# Altium schematic sheet IO.SchDoc: IO
size 420 x 297 mm; DocumentNumber: 6; SheetNumber: 2; SheetTotal: 15
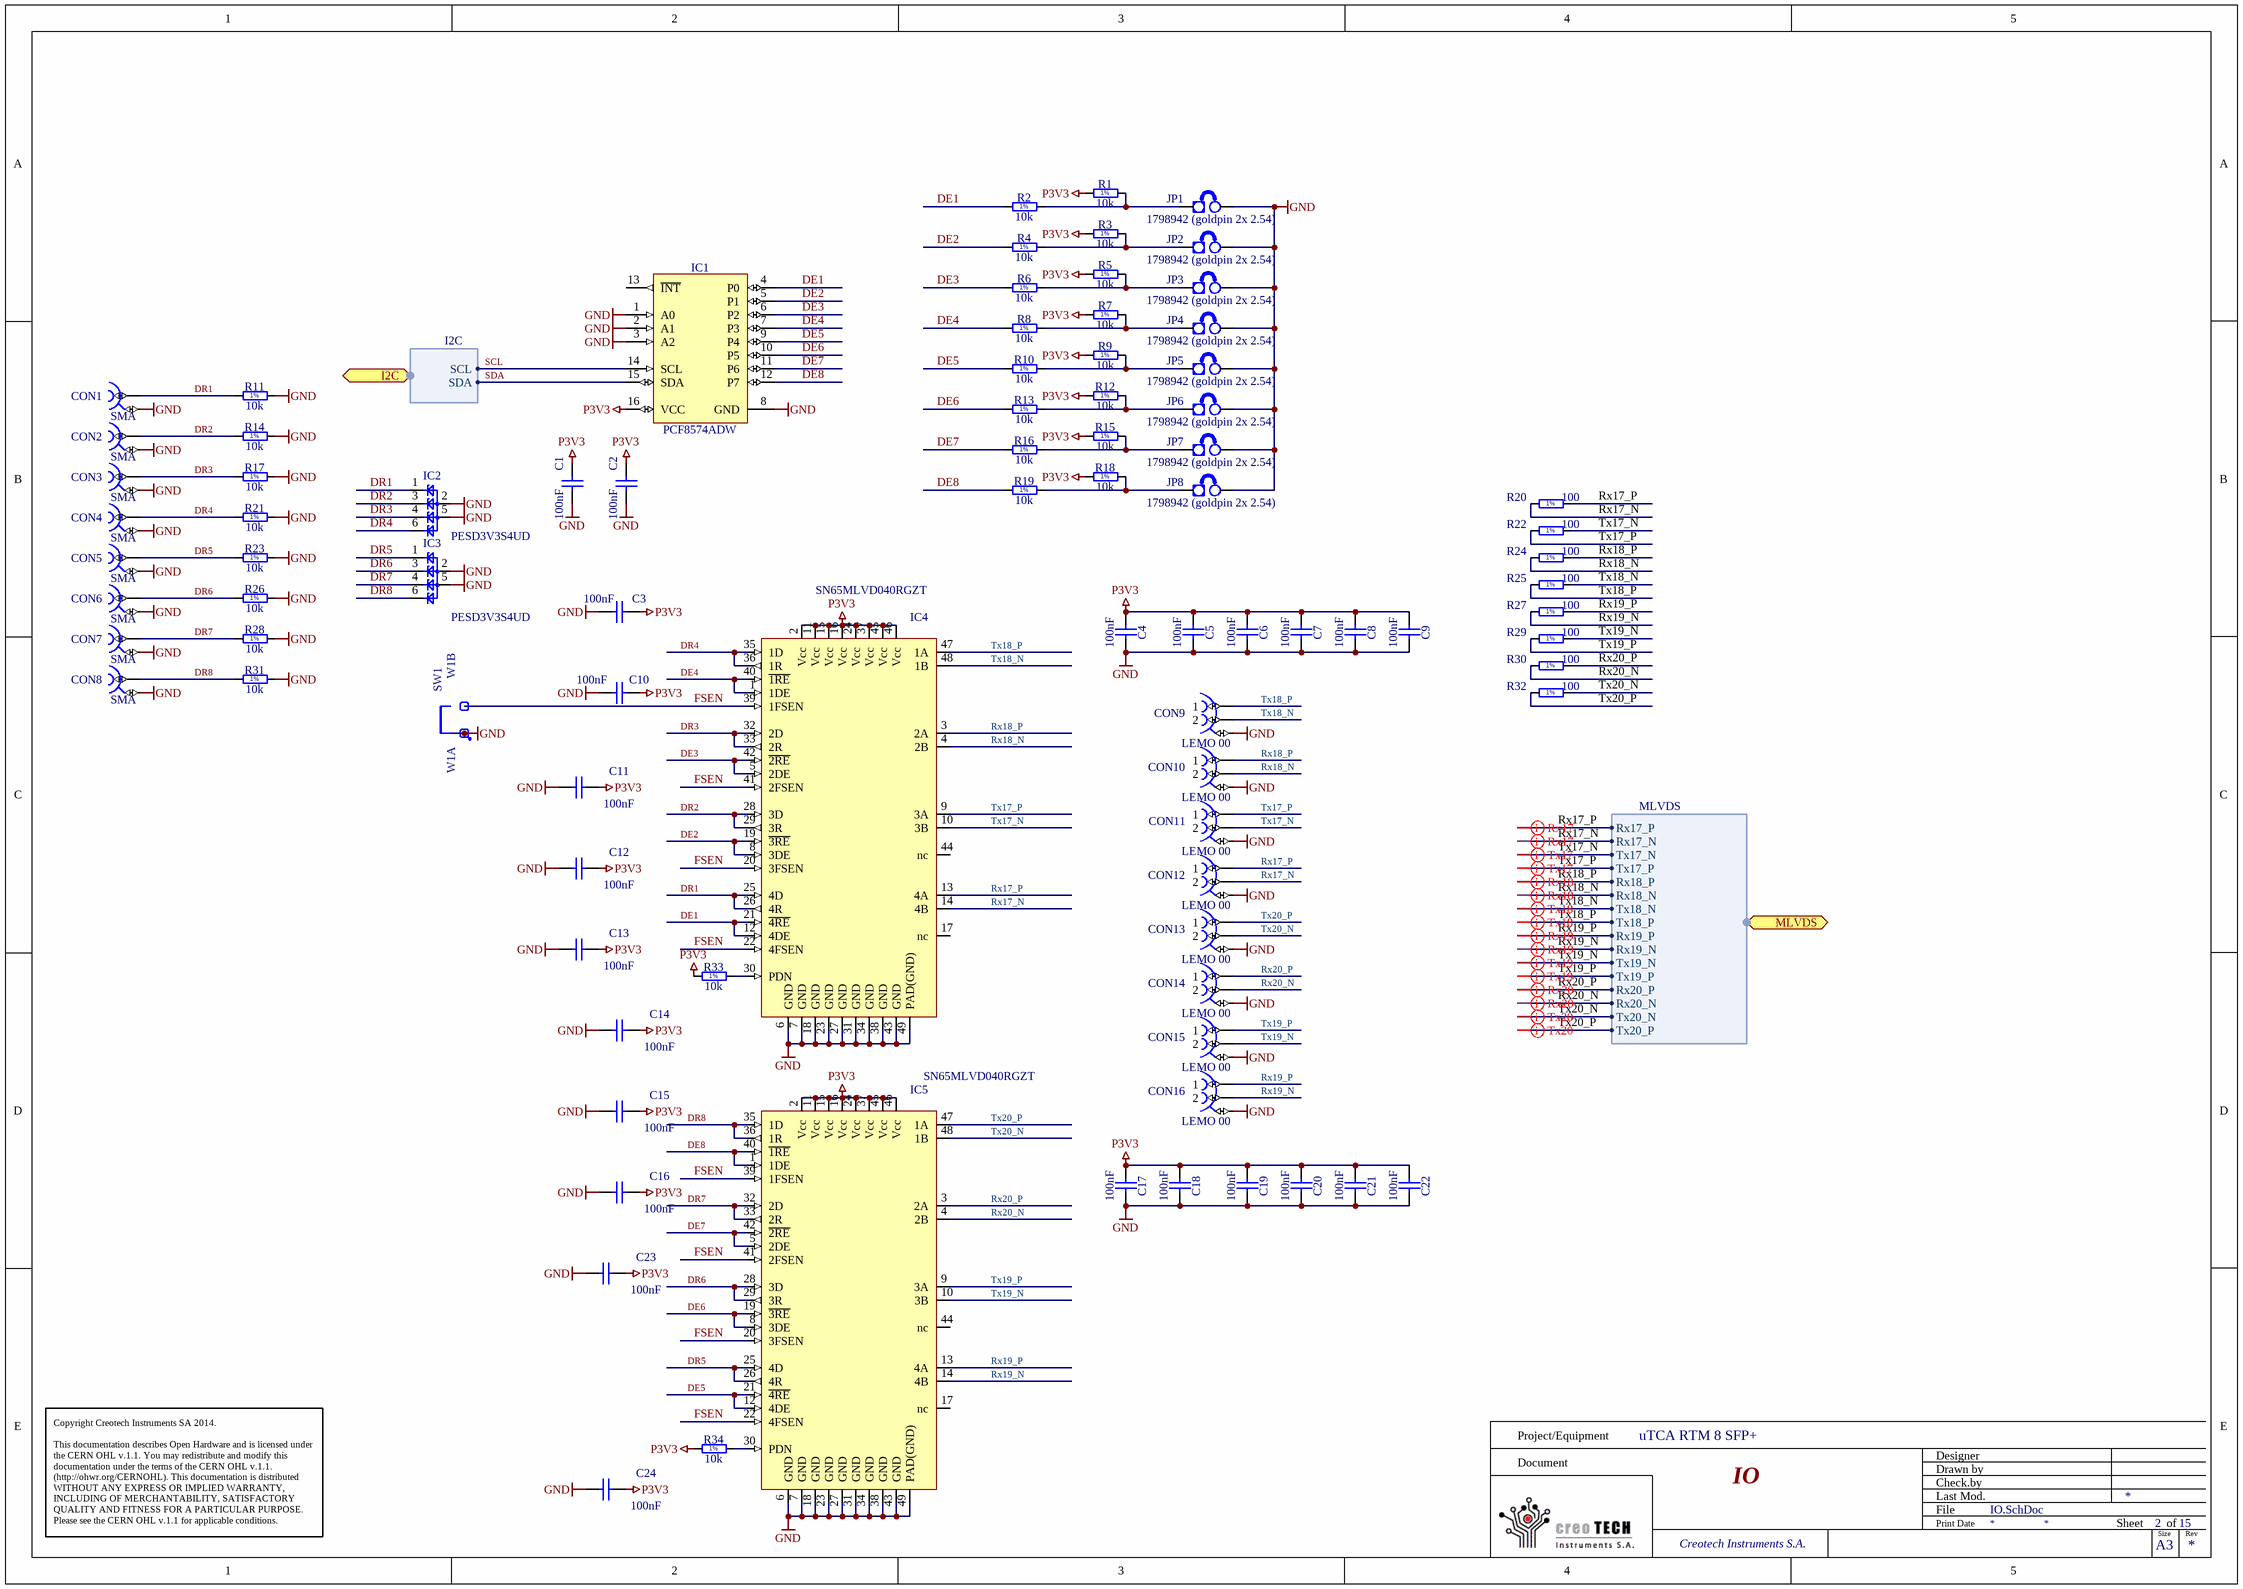
[diagram p0: IO.SchDoc]

## Parts
C1  100nF  [CAPC0603X33N]
C2  100nF  [CAPC0603X33N]
C3  100nF  [CAPC0603X33N]
C4  100nF  [CAPC0603X33N]
C5  100nF  [CAPC0603X33N]
C6  100nF  [CAPC0603X33N]
C7  100nF  [CAPC0603X33N]
C8  100nF  [CAPC0603X33N]
C9  100nF  [CAPC0603X33N]
C10  100nF  [CAPC0603X33N]
C11  100nF  [CAPC0603X33N]
C12  100nF  [CAPC0603X33N]
C13  100nF  [CAPC0603X33N]
C14  100nF  [CAPC0603X33N]
C15  100nF  [CAPC0603X33N]
C16  100nF  [CAPC0603X33N]
C17  100nF  [CAPC0603X33N]
C18  100nF  [CAPC0603X33N]
C19  100nF  [CAPC0603X33N]
C20  100nF  [CAPC0603X33N]
C21  100nF  [CAPC0603X33N]
C22  100nF  [CAPC0603X33N]
C23  100nF  [CAPC0603X33N]
C24  100nF  [CAPC0603X33N]
CON1  SMA  [HUBER-SUHNER_85 SMA-50-0-101/111 NE]
CON2  SMA  [HUBER-SUHNER_85 SMA-50-0-101/111 NE]
CON3  SMA  [HUBER-SUHNER_85 SMA-50-0-101/111 NE]
CON4  SMA  [HUBER-SUHNER_85 SMA-50-0-101/111 NE]
CON5  SMA  [HUBER-SUHNER_85 SMA-50-0-101/111 NE]
CON6  SMA  [HUBER-SUHNER_85 SMA-50-0-101/111 NE]
CON7  SMA  [HUBER-SUHNER_85 SMA-50-0-101/111 NE]
CON8  SMA  [HUBER-SUHNER_85 SMA-50-0-101/111 NE]
CON9  LEMO 00  [LEMO_EPG.00.302.NLN]
CON10  LEMO 00  [LEMO_EPG.00.302.NLN]
CON11  LEMO 00  [LEMO_EPG.00.302.NLN]
CON12  LEMO 00  [LEMO_EPG.00.302.NLN]
CON13  LEMO 00  [LEMO_EPG.00.302.NLN]
CON14  LEMO 00  [LEMO_EPG.00.302.NLN]
CON15  LEMO 00  [LEMO_EPG.00.302.NLN]
CON16  LEMO 00  [LEMO_EPG.00.302.NLN]
IC1  PCF8574ADW  [SOIC127P1030X265-16N]
IC2  PESD3V3S4UD  [SOT457]
IC3  PESD3V3S4UD  [SOT457]
IC4  SN65MLVD040RGZT  [QFN48L]
IC5  SN65MLVD040RGZT  [QFN48L]
JP1  1798942 (goldpin 2x 2.54)  [HEADER2x1 2.54mm]
JP2  1798942 (goldpin 2x 2.54)  [HEADER2x1 2.54mm]
JP3  1798942 (goldpin 2x 2.54)  [HEADER2x1 2.54mm]
JP4  1798942 (goldpin 2x 2.54)  [HEADER2x1 2.54mm]
JP5  1798942 (goldpin 2x 2.54)  [HEADER2x1 2.54mm]
JP6  1798942 (goldpin 2x 2.54)  [HEADER2x1 2.54mm]
JP7  1798942 (goldpin 2x 2.54)  [HEADER2x1 2.54mm]
JP8  1798942 (goldpin 2x 2.54)  [HEADER2x1 2.54mm]
R1  10k  [RESC1005X40N]
R2  10k  [RESC1005X40N]
R3  10k  [RESC1005X40N]
R4  10k  [RESC1005X40N]
R5  10k  [RESC1005X40N]
R6  10k  [RESC1005X40N]
R7  10k  [RESC1005X40N]
R8  10k  [RESC1005X40N]
R9  10k  [RESC1005X40N]
R10  10k  [RESC1005X40N]
R11  10k  [RESC1005X40N]
R12  10k  [RESC1005X40N]
R13  10k  [RESC1005X40N]
R14  10k  [RESC1005X40N]
R15  10k  [RESC1005X40N]
R16  10k  [RESC1005X40N]
R17  10k  [RESC1005X40N]
R18  10k  [RESC1005X40N]
R19  10k  [RESC1005X40N]
R20  100  [RESC1005X40N]
R21  10k  [RESC1005X40N]
R22  100  [RESC1005X40N]
R23  10k  [RESC1005X40N]
R24  100  [RESC1005X40N]
R25  100  [RESC1005X40N]
R26  10k  [RESC1005X40N]
R27  100  [RESC1005X40N]
R28  10k  [RESC1005X40N]
R29  100  [RESC1005X40N]
R30  100  [RESC1005X40N]
R31  10k  [RESC1005X40N]
R32  100  [RESC1005X40N]
R33  10k  [RESC1005X40N]
R34  10k  [RESC1005X40N]
SW1  Jumper Type1  [JUMPER_BLACK_INSULATED_2.54MM]  (value not drawn)
W1  Test Point  [COMATEL_385.0358.1.02.400]  (value not drawn)  (parts A,B of 2)

## Ports
I2C (harness I2C), MLVDS (harness MLVDS)

## Harnesses
MLVDS: Rx17_P, Rx17_N, Tx17_N, Tx17_P, Rx18_P, Rx18_N, Tx18_N, Tx18_P, Rx19_P, Rx19_N, Tx19_N, Tx19_P, Rx20_P, Rx20_N, Tx20_N, Tx20_P
I2C: SCL, SDA

## Nets
GND: C1.1 C2.1 C3.1 C4.2 C5.2 C6.2 C7.2 C8.2 C9.2 C10.1 C11.2 C12.2 C13.2 C14.2 C15.2 C16.2 C17.2 C18.2 C19.2 C20.2 C21.2 C22.2 C23.2 C24.2 CON1.2 CON2.2 CON3.2 CON4.2 CON5.2 CON6.2 CON7.2 CON8.2 CON9.3 CON10.3 CON11.3 CON12.3 CON13.3 CON14.3 CON15.3 CON16.3 IC1.1(A0) IC1.2(A1) IC1.3(A2) IC1.8(GND) IC2.2 IC2.5 IC3.2 IC3.5 IC4.6(GND) IC4.7(GND) IC4.18(GND) IC4.23(GND) IC4.27(GND) IC4.31(GND) IC4.34(GND) IC4.38(GND) IC4.43(GND) IC4.49(PAD(GND)) IC5.6(GND) IC5.7(GND) IC5.18(GND) IC5.23(GND) IC5.27(GND) IC5.31(GND) IC5.34(GND) IC5.38(GND) IC5.43(GND) IC5.49(PAD(GND)) JP1.2(E2) JP2.2(E2) JP3.2(E2) JP4.2(E2) JP5.2(E2) JP6.2(E2) JP7.2(E2) JP8.2(E2) R11.2 R14.2 R17.2 R21.2 R23.2 R26.2 R28.2 R31.2 SW1.1 W1.1
P3V3: C1.2 C2.2 C3.2 C4.1 C5.1 C6.1 C7.1 C8.1 C9.1 C10.2 C11.1 C12.1 C13.1 C14.1 C15.1 C16.1 C17.1 C18.1 C19.1 C20.1 C21.1 C22.1 C23.1 C24.1 IC1.16(VCC) IC4.2(Vcc) IC4.11(Vcc) IC4.15(Vcc) IC4.16(Vcc) IC4.24(Vcc) IC4.37(Vcc) IC4.45(Vcc) IC4.46(Vcc) IC5.2(Vcc) IC5.11(Vcc) IC5.15(Vcc) IC5.16(Vcc) IC5.24(Vcc) IC5.37(Vcc) IC5.45(Vcc) IC5.46(Vcc) R1.1 R3.1 R5.1 R7.1 R9.1 R12.1 R15.1 R18.1 R33.1 R34.1
DE1: IC1.4(P0) IC4.12(4DE) IC4.21(~{4RE}) R2.1
DE2: IC1.5(P1) IC4.8(3DE) IC4.19(~{3RE}) R4.1
DE3: IC1.6(P2) IC4.5(2DE) IC4.42(~{2RE}) R6.1
DE4: IC1.7(P3) IC4.1(1DE) IC4.40(~{1RE}) R8.1
DE5: IC1.9(P4) IC5.12(4DE) IC5.21(~{4RE}) R10.1
DE6: IC1.10(P5) IC5.8(3DE) IC5.19(~{3RE}) R13.1
DE7: IC1.11(P6) IC5.5(2DE) IC5.42(~{2RE}) R16.1
DE8: IC1.12(P7) IC5.1(1DE) IC5.40(~{1RE}) R19.1
DR1: CON1.1 IC2.1 IC4.25(4D) IC4.26(4R) R11.1
DR2: CON2.1 IC2.3 IC4.28(3D) IC4.29(3R) R14.1
DR3: CON3.1 IC2.4 IC4.32(2D) IC4.33(2R) R17.1
DR4: CON4.1 IC2.6 IC4.35(1D) IC4.36(1R) R21.1
DR5: CON5.1 IC3.1 IC5.25(4D) IC5.26(4R) R23.1
DR6: CON6.1 IC3.3 IC5.28(3D) IC5.29(3R) R26.1
DR7: CON7.1 IC3.4 IC5.32(2D) IC5.33(2R) R28.1
DR8: CON8.1 IC3.6 IC5.35(1D) IC5.36(1R) R31.1
FSEN: IC4.20(3FSEN) IC4.22(4FSEN) IC4.39(1FSEN) IC4.41(2FSEN) IC5.20(3FSEN) IC5.22(4FSEN) IC5.39(1FSEN) IC5.41(2FSEN) W1.2
Rx17_N: CON12.2 IC4.14(4B) R20.1 ; port MLVDS.Rx17_N
Rx17_P: CON12.1 IC4.13(4A) R20.2 ; port MLVDS.Rx17_P
Rx18_N: CON10.2 IC4.4(2B) R24.1 ; port MLVDS.Rx18_N
Rx18_P: CON10.1 IC4.3(2A) R24.2 ; port MLVDS.Rx18_P
Rx19_N: CON16.2 IC5.14(4B) R27.1 ; port MLVDS.Rx19_N
Rx19_P: CON16.1 IC5.13(4A) R27.2 ; port MLVDS.Rx19_P
Rx20_N: CON14.2 IC5.4(2B) R30.1 ; port MLVDS.Rx20_N
Rx20_P: CON14.1 IC5.3(2A) R30.2 ; port MLVDS.Rx20_P
SCL: IC1.14(SCL) ; port I2C.SCL
SDA: IC1.15(SDA) ; port I2C.SDA
Tx17_N: CON11.2 IC4.10(3B) R22.2 ; port MLVDS.Tx17_N
Tx17_P: CON11.1 IC4.9(3A) R22.1 ; port MLVDS.Tx17_P
Tx18_N: CON9.2 IC4.48(1B) R25.2 ; port MLVDS.Tx18_N
Tx18_P: CON9.1 IC4.47(1A) R25.1 ; port MLVDS.Tx18_P
Tx19_N: CON15.2 IC5.10(3B) R29.2 ; port MLVDS.Tx19_N
Tx19_P: CON15.1 IC5.9(3A) R29.1 ; port MLVDS.Tx19_P
Tx20_N: CON13.2 IC5.48(1B) R32.2 ; port MLVDS.Tx20_N
Tx20_P: CON13.1 IC5.47(1A) R32.1 ; port MLVDS.Tx20_P
NetIC4_30: IC4.30(PDN) R33.2
NetIC5_30: IC5.30(PDN) R34.2
NetJP1_1: JP1.1(E1) R1.2 R2.2
NetJP2_1: JP2.1(E1) R3.2 R4.2
NetJP3_1: JP3.1(E1) R5.2 R6.2
NetJP4_1: JP4.1(E1) R7.2 R8.2
NetJP5_1: JP5.1(E1) R9.2 R10.2
NetJP6_1: JP6.1(E1) R12.2 R13.2
NetJP7_1: JP7.1(E1) R15.2 R16.2
NetJP8_1: JP8.1(E1) R18.2 R19.2

Not connected (* = marked no-connect by the designer): IC1 13(~{INT}); IC4 17(nc) 44(nc); IC5 17(nc) 44(nc)

## Layout directives
differential pair: Rx17_N, Rx17_P, Rx18_N, Rx18_P, Rx19_N, Rx19_P, Rx20_N, Rx20_P, Tx17_N, Tx17_P, Tx18_N, Tx18_P, Tx19_N, Tx19_P, Tx20_N, Tx20_P

## Notes on the sheet
- Project/Equipment
- Document
- uTCA RTM 8 SFP+
- Designer
- Drawn by
- Check.by
- Copyright Creotech Instruments SA 2014.
  This documentation describes Open Hardware and is licensed under the CERN OHL v.1.1. You may redistribute and modify this documentation under the terms of the CERN OHL v.1.1. (http://ohwr.org/CERNOHL). This documentation is distributed WITHOUT ANY EXPRESS OR IMPLIED WARRANTY, INCLUDING OF MERCHANTABILITY, SATISFACTORY QUALITY AND FITNESS FOR A PARTICULAR PURPOSE. Please see the CERN OHL v.1.1 for applicable conditions.
- Creotech Instruments S.A.
- File
- Last Mod.
- Print Date
- Sheet
- Size
- A3
- of
- Rev
- (in symbol R0402_10K_1%_0.0625W_100PPM) 1%
- (in symbol R0402_100R_1%_0.0625W_100PPM) 1%

## Library data of the parts
C1-C24 = CC0201_100NF_6.3V_10%_X5R: Non-polarised capacitor; Part Description: SMD Multilayer Chip Ceramic Capacitor; Manufacturer: GENERIC; Manufacturer1 Part Number: 02016D104KAT2A; Voltage: 6.3V; TC: X5R; Tolerance: ±10%; Table: Capacitors SMD; Part Number: CC0201_100NF_6.3V_10%_X5R; Component Kind: Standard; Component Type: Standard; Pin Count: 2; Value: 100nF; Status: Not Recommended; Manufacturer Part Number: CC0201_100NF_6.3V_10%_X5R; Case: 0201; Mounted: Yes; Socket: No; SMD: Yes; Manufacturer1 Example: AVX; Manufacturer1 ComponentHeight: 0.33mm; HelpURL: \\cern.ch\dfs\Applications\Altium\Datasheets\CC0201_X5R_AVX.pdf; Author: CERN DEM JLC; CreateDate: 2007-12-03; LatestRevisionDate: 2007-12-03
CON1-CON8 = HUBER-SUHNER_85_SMA-50-0-101/111_NE: Part Description: SMA 50 Ohms Right Angle PCB Jack; Manufacturer: HUBER+SUHNER; Table: Miscellaneous; Part Number: HUBER-SUHNER_85_SMA-50-0-101/111_NE; Component Kind: Standard; Component Type: Standard; Pin Count: 2; Family: SMA; Mounted: Yes; Socket: No; SMD: No; Status: None; Manufacturer Part Number: 85_SMA-50-0-101/111_NE; ComponentHeight: 9.6mm; HelpURL: \\cern.ch\dfs\Applications\Altium\Datasheets\HUBER-SUHNER_85 SMA-50-0-101-111 NE.pdf; Author: CERN DEM JLC; CreateDate: 2010-04-20; LatestRevisionDate: 2010-04-27
CON9-CON16 = LEMO_EPG.00.302.NLN: Part Description: Size 00, Elbow Socket (90°) With 2 Female Contacts and Alignment Key (G); SCEM: 09.31.28.007.2; Part Number: LEMO_EPG.00.302.NLN; Component Kind: Standard; Component Type: Standard; Pin Count: 3; Family: LEMO 00; Mounted: Yes; Socket: No; SMD: No; Status: None; Manufacturer: LEMO; Manufacturer Part Number: EPG.00.302.NLN; ComponentHeight: 7mm; HelpURL: \\cern.ch\dfs\Applications\Altium\Datasheets\LEMO_EPG.00.302.NLN.pdf; Author: CERN DEM JLC; CreateDate: 2010-08-25; LatestRevisionDate: 2010-12-20; Table: LEMO
IC1 = PCF8574ADW: Remote 8-bit I/O Expander For I2C Bus; Manufacturer: TEXAS INSTRUMENTS; Table: Analog & Interface; Part Number: PCF8574ADW; Component Kind: Standard; Component Type: Standard; Device: PCF8574ADW; PackageDescription: SOIC 16, Pitch 1.27mm - Body 7.5x10.3mm, IPC Medium Density; Part Description: Remote 8-bit I/O Expander For I2C Bus; Manufacturer Part Number: PCF8574ADW; Pin Count: 16; Case: SOIC16W; Mounted: Yes; Socket: No; SMD: Yes; ComponentHeight: 2.65mm; Author: CERN DEM JLC; HelpURL: \\cern.ch\dfs\Applications\Altium\Datasheets\PCF8574ADW.pdf; CreateDate: 2012-11-01; LatestRevisionDate: 2012-11-01
IC2 IC3 = D_TVS_PESD3V3S4UD: 3.3V TVS
IC4 IC5 = IFC_SN65MLVD040
JP1-JP8 = JUMPER: Supplier 1: Farnell; Supplier Part Number 1: 1798942
R1-R19 R21 R23 R26 R28 R31 R33 R34 = R0402_10K_1%_0.0625W_100PPM: Resistor - 1%; Part Description: General Purpose Thick Film Chip Resistor; Manufacturer: GENERIC; Manufacturer1 Part Number: 232270671003L; TC: ±100ppm/°C; Table: Resistors SMD; Part Number: R0402_10K_1%_0.0625W_100PPM; Component Kind: Standard; Component Type: Standard; Pin Count: 2; Value: 10k; Status: Not recommended; Power: 0.0625W; Tolerance: ±1%; Manufacturer Part Number: R0402_10K_1%_0.0625W_100PPM; Case: 0402; Mounted: Yes; Socket: No; SMD: Yes; Manufacturer1 Example: YAGEO PHYCOMP; Manufacturer1 ComponentHeight: 0.4mm; HelpURL: \\cern.ch\dfs\Applications\Altium\Datasheets\R0402_Phycomp_RC0402.pdf; Author: CERN DEM JLC; CreateDate: 2007-12-03; LatestRevisionDate: 2012-10-17
R20 R22 R24 R25 R27 R29 R30 R32 = R0402_100R_1%_0.0625W_100PPM: Resistor - 1%; Part Description: General Purpose Thick Film Chip Resistor; Manufacturer: GENERIC; Manufacturer1 Part Number: 232270671001L; TC: ±100ppm/°C; Table: Resistors SMD; Part Number: R0402_100R_1%_0.0625W_100PPM; Component Kind: Standard; Component Type: Standard; Pin Count: 2; Value: 100; Status: Not recommended; Power: 0.0625W; Tolerance: ±1%; Manufacturer Part Number: R0402_100R_1%_0.0625W_100PPM; Case: 0402; Mounted: Yes; Socket: No; SMD: Yes; Manufacturer1 Example: YAGEO PHYCOMP; Manufacturer1 ComponentHeight: 0.4mm; HelpURL: \\cern.ch\dfs\Applications\Altium\Datasheets\R0402_Phycomp_RC0402.pdf; Author: CERN DEM JLC; CreateDate: 2007-12-03; LatestRevisionDate: 2012-10-17
SW1 = COMATEL_313.1730.0.00.40.0: Jumper 1 Pin; Part Description: Closed Insulated Black Jumper Pitch 2.54mm; Manufacturer: KONTEK COMATEL; SCEM: 09.55.10.960.9; Table: STELVIO-KONTEK COMATEL; Part Number: COMATEL_313.1730.0.00.40.0; Component Kind: Standard; Component Type: Standard; Pin Count: 1; Family: Jumper; Mounted: Yes; Socket: No; SMD: No; Status: Obsolete; Manufacturer Part Number: 313.1730.0.00.40.0; ComponentHeight: 6.5mm; HelpURL: \\cern.ch\dfs\Applications\Altium\Datasheets\COMATEL_313.1730.0.00.40.0.pdf; Author: CERN DEM JLC; CreateDate: 2008-04-09; LatestRevisionDate: 2013-08-27
W1 = COMATEL_385.0358.1.02.400: 2 Mini Wire-Wrap Contact Strip Header; Part Description: 2 Contacts Straight Strip Header Pitch 2.54mm L=6.3mm ''Mini-Wire-Wrap''; Manufacturer: KONTEK COMATEL; Table: STELVIO-KONTEK COMATEL; Part Number: COMATEL_385.0358.1.02.400; Component Kind: Standard; Component Type: Standard; Pin Count: 2; Family: Test Point; Mounted: Yes; Socket: No; SMD: No; Status: Not recommended; Manufacturer Part Number: 385.0358.1.02.400; ComponentHeight: 8mm; HelpURL: \\cern.ch\dfs\Applications\Altium\Datasheets\COMATEL_385.0358.1.02.400.pdf; Author: CERN DEM JLC; CreateDate: 2010-06-30; LatestRevisionDate: 2012-10-10